# EAGLE design ATtiny104XNANOaddon (EAGLE 7.2.0)
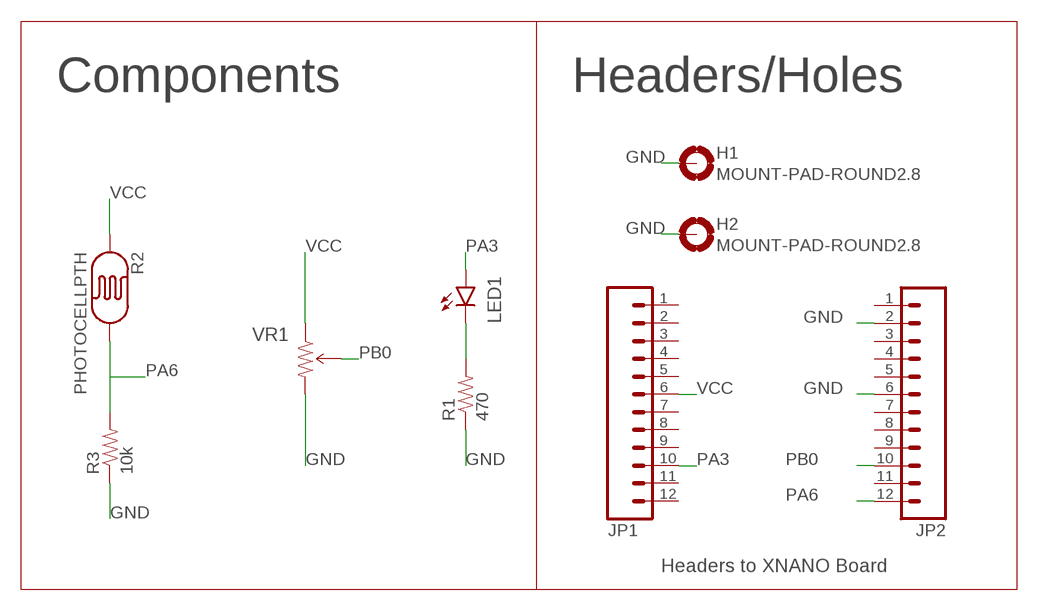
[diagram p0: schematic, sheet 1]

## Parts
D1  LED5MM  [LED5MM]
H1  MOUNT-PAD-ROUND2.8  [2,8-PAD]
H2  MOUNT-PAD-ROUND2.8  [2,8-PAD]
JP1  M12NO_SILK  [1X12_NO_SILK]
JP2  M12NO_SILK  [1X12_NO_SILK]
R1  470  RESISTORPTH-1/4W  [AXIAL-0.4]
R2  PHOTOCELLPTH  [PHOTOCELL]
R3  10k  RESISTORPTH-1/4W  [AXIAL-0.4]
R4  TRIMPOT-PTH-KNOB  [3386U]

## Nets
GND: H1.B2,8(MOUNT) H2.B2,8(MOUNT) JP2.2 JP2.6 R1.P$1 R3.P$1 R4.3(CW)
LED1: D1.K(C) R1.P$2
PA3: D1.A JP1.10
PA6: JP2.12 R2.2 R3.P$2
PB0: JP2.10 R4.2(WIPER)
VCC: JP1.6 R2.1 R4.1(CCW)
Unconnected: JP1.1 JP1.2 JP1.3 JP1.4 JP1.5 JP1.7 JP1.8 JP1.9 JP1.11 JP1.12 JP2.1 JP2.3 JP2.4 JP2.5 JP2.7 JP2.8 JP2.9 JP2.11

## Notes on the sheet
- Components | Headers/Holes
- LED1
- VR1
- Headers to XNANO Board

## Library data of the parts
D1 = SparkFun-LED:LED: LEDs Standard schematic elements and footprints for 5mm, 3mm, 1206, and 0603 sized LEDs. 5mm - Spark Fun Electronics SKU : COM-00529 (and others)
H1 H2 = holes:MOUNT-PAD-ROUND: MOUNTING PAD, round
JP1 JP2 = SparkFun-Connectors:M12: Header 12 Standard 12-pin 0.1" header. Use with straight break away headers (SKU : PRT-00116), right angle break away headers (PRT-00553), swiss pins (PRT-00743), machine pins (PRT-00117), and female headers (PRT-00115).
R1 R3 = SparkFun-Resistors:RESISTOR: Resistor Basic schematic elements and footprints for 0603, 1206, and PTH resistors.
R2 = SparkFun-Sensors:PHOTOCELL: CdS photoresistor. This is a low cost way to detect light levels. Resistance decreases with more incoming light. SparkFun SKU: SEN-09088
R4 = SparkFun-Electromechanical:TRIMPOT: Various small potentiometers for "set-and-forget" applications

## Board
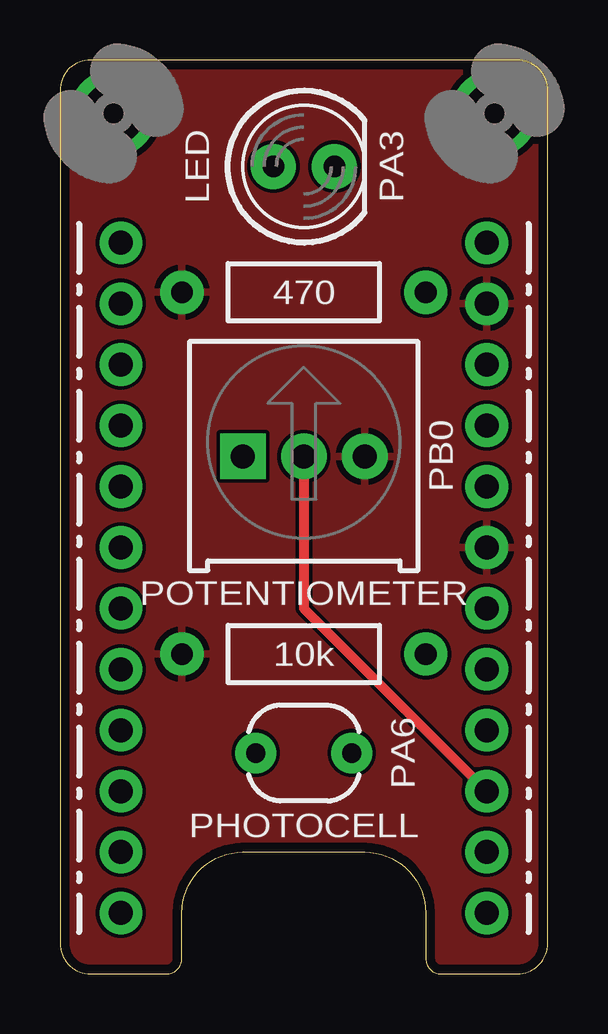
[diagram p1: board, top side]
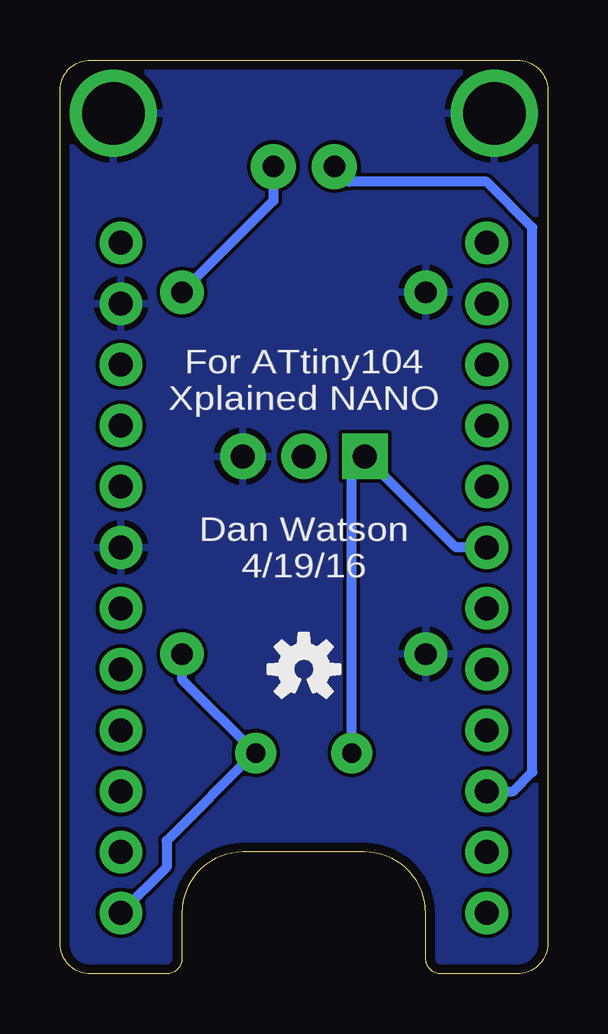
[diagram p2: board, bottom side, seen from below]

Size 20.32 x 38.1 mm. Coordinates in mm from the lower left corner, seen from the top.
Outline: 0,36.83 0,1.27 arc90 1.27,0 4.45,0 arc90 5.08,0.64 5.08,2.54 arc-90 7.62,5.08 12.7,5.08 arc-90 15.24,2.54 15.24,0.64 arc90 15.88,0 19.05,0 arc90 20.32,1.27 20.32,36.83 arc90 19.05,38.1 1.27,38.1 arc90 0,36.83
Copper layers (1*16): Top 0.0356mm / dielectric 1.5011mm / Bottom 0.0356mm
Design rules "oshpark-2layer": minimum track width 6mil, minimum drill 13mil, track to track 6mil, track to pad 6mil, pad to pad 6mil, via to via 6mil, smd to smd 6mil, copper to edge 15mil, drill to drill 6mil, minimum pad ring 7mil, minimum via ring 7mil, stop-mask expansion 4mil, vias tented up to drill 0mil, thermal gap 10mil

### Footprints (pad centres in the part's own frame; a part is rotated, then mirrored left to right if it is on the bottom)
LED5MM = drill 0.9 pad 1.88: A -1.27,0; K 1.27,0
2,8-PAD = drill 2.6 pad 3.6: B2,8 0,0
1X12_NO_SILK = drill 1 pad 1.778: 1 0,0; 2 2.54,0; 3 5.08,0; 4 7.62,0; 5 10.16,0; 6 12.7,0; 7 15.24,0; 8 17.78,0; 9 20.32,0; 10 22.86,0; 11 25.4,0; 12 27.94,0
AXIAL-0.4 = drill 0.9 pad 1.8: P$1 -5.08,0; P$2 5.08,0
PHOTOCELL = drill 0.8 pad 1.7: 1 -2,0; 2 2,0
3386U = drill 1 pad 1.9 square: 1 -2.54,-0.015 | drill 1 pad 1.9: 2 0,-0.015; 3 2.54,-0.015

### Placement (x,y rotation side)
D1  10.16,33.66 0 top
H1  2.22,35.88 0 top
H2  18.1,35.88 0 top
JP1  2.54,30.48 270 top
JP2  17.78,30.48 270 top
R1  10.16,28.42 0 top
R2  10.16,9.21 0 top
R3  10.16,13.34 0 top
R4  10.16,21.59 0 top
U$1  [OSHW-LOGO-S]  10.16,12.7 0 bottom

### Tracks (layer width: path | path; a pad name or v marks a point on that pad's centre or on a via)
GND
  pour Top: -1.27,39.37 -1.27,-1.27 21.59,-1.27 21.59,39.37
  pour Bottom: -2.54,40.64 -2.54,-2.54 22.86,-2.54 22.86,40.64
LED1
  Bottom 0.406: D1.K 11.43,32.23 R1.P$2
PA3
  Bottom 0.406: JP1.10 1.43,7.62 0.64,8.41 0.64,31.11 2.54,33.02 8.26,33.02 D1.A
PA6
  Bottom 0.406: R3.P$2 15.24,12.29 R2.2 12.22,9.21 15.88,5.56 15.88,4.45 JP2.12
PB0
  Top 0.406: R4.2 10.16,15.24 JP2.10
VCC
  Bottom 0.406: JP1.6 3.83,17.78 R4.1 8.16,21.04 R2.1

### Text on the board
tNames: LED | PA3 | 470 | PB0 | POTENTIOMETER | 10k | PA6 | PHOTOCELL
bNames: For ATtiny104 / Xplained NANO | Dan Watson / 4/19/16